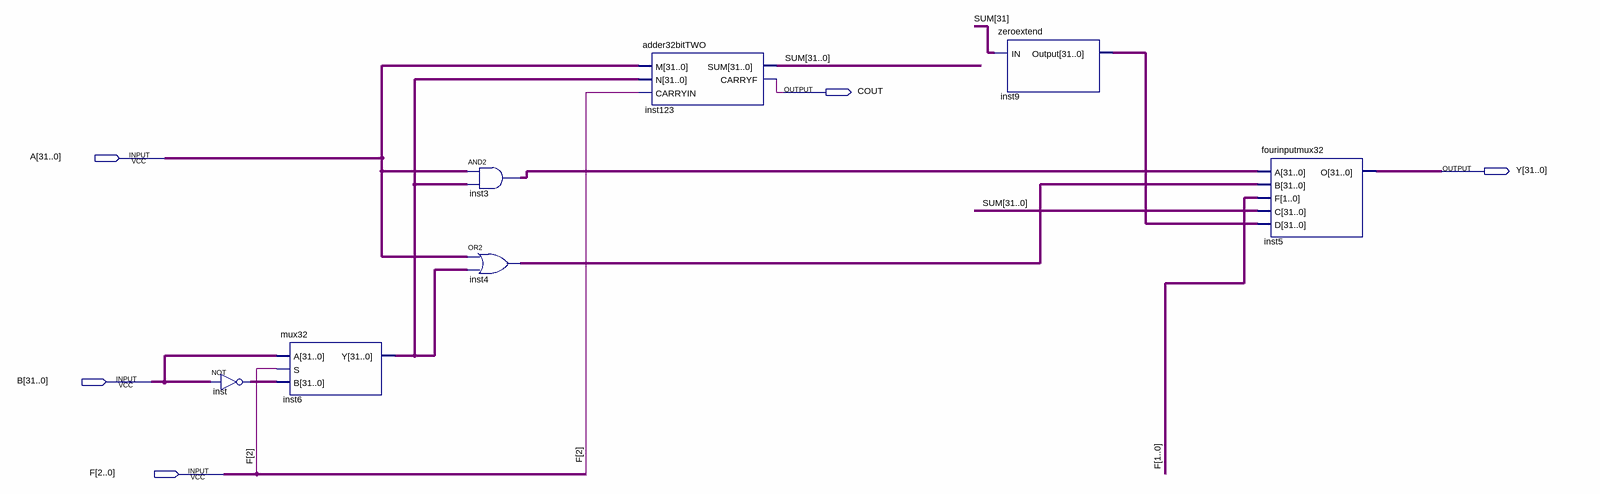
[diagram p0: schematic sheet]
// Quartus schematic ALU.bdf as structural Verilog: 7 symbols, 5 pins
module ALU (
  input  [31:0] A,
  input  [31:0] B,
  input  [2:0] F,
  output COUT,
  output [31:0] Y
);

  wire [31:0] inst3_out, inst4_out, inst6_y, inst9_output, inst_out, SUM;

  assign inst_out = ~B;  // NOT inst, 32 bits wide
  mux32 inst6 (.A(B), .S(F[2]), .B(inst_out), .Y(inst6_y));
  assign inst3_out = A & inst6_y;  // AND2 inst3, 32 bits wide
  assign inst4_out = A | inst6_y;  // OR2 inst4, 32 bits wide
  adder32bitTWO inst123 (.M(A), .N(inst6_y), .CARRYIN(F[2]), .SUM(SUM), .CARRYF(COUT));
  zeroextend inst9 (.IN(SUM[31]), .Output(inst9_output));
  fourinputmux32 inst5 (.A(inst3_out), .B(inst4_out), .F(F[1:0]), .C(SUM), .D(inst9_output), .O(Y));
endmodule
